# Altium schematic sheet MeteringIC.SchDoc
size 299 x 240 mm; SheetNumber: 4; SheetTotal: 7; ENG_APP_DATE: --/--/--; DSN_APP_DATE: --/--/--; CHK_APP_DATE: --/--/--
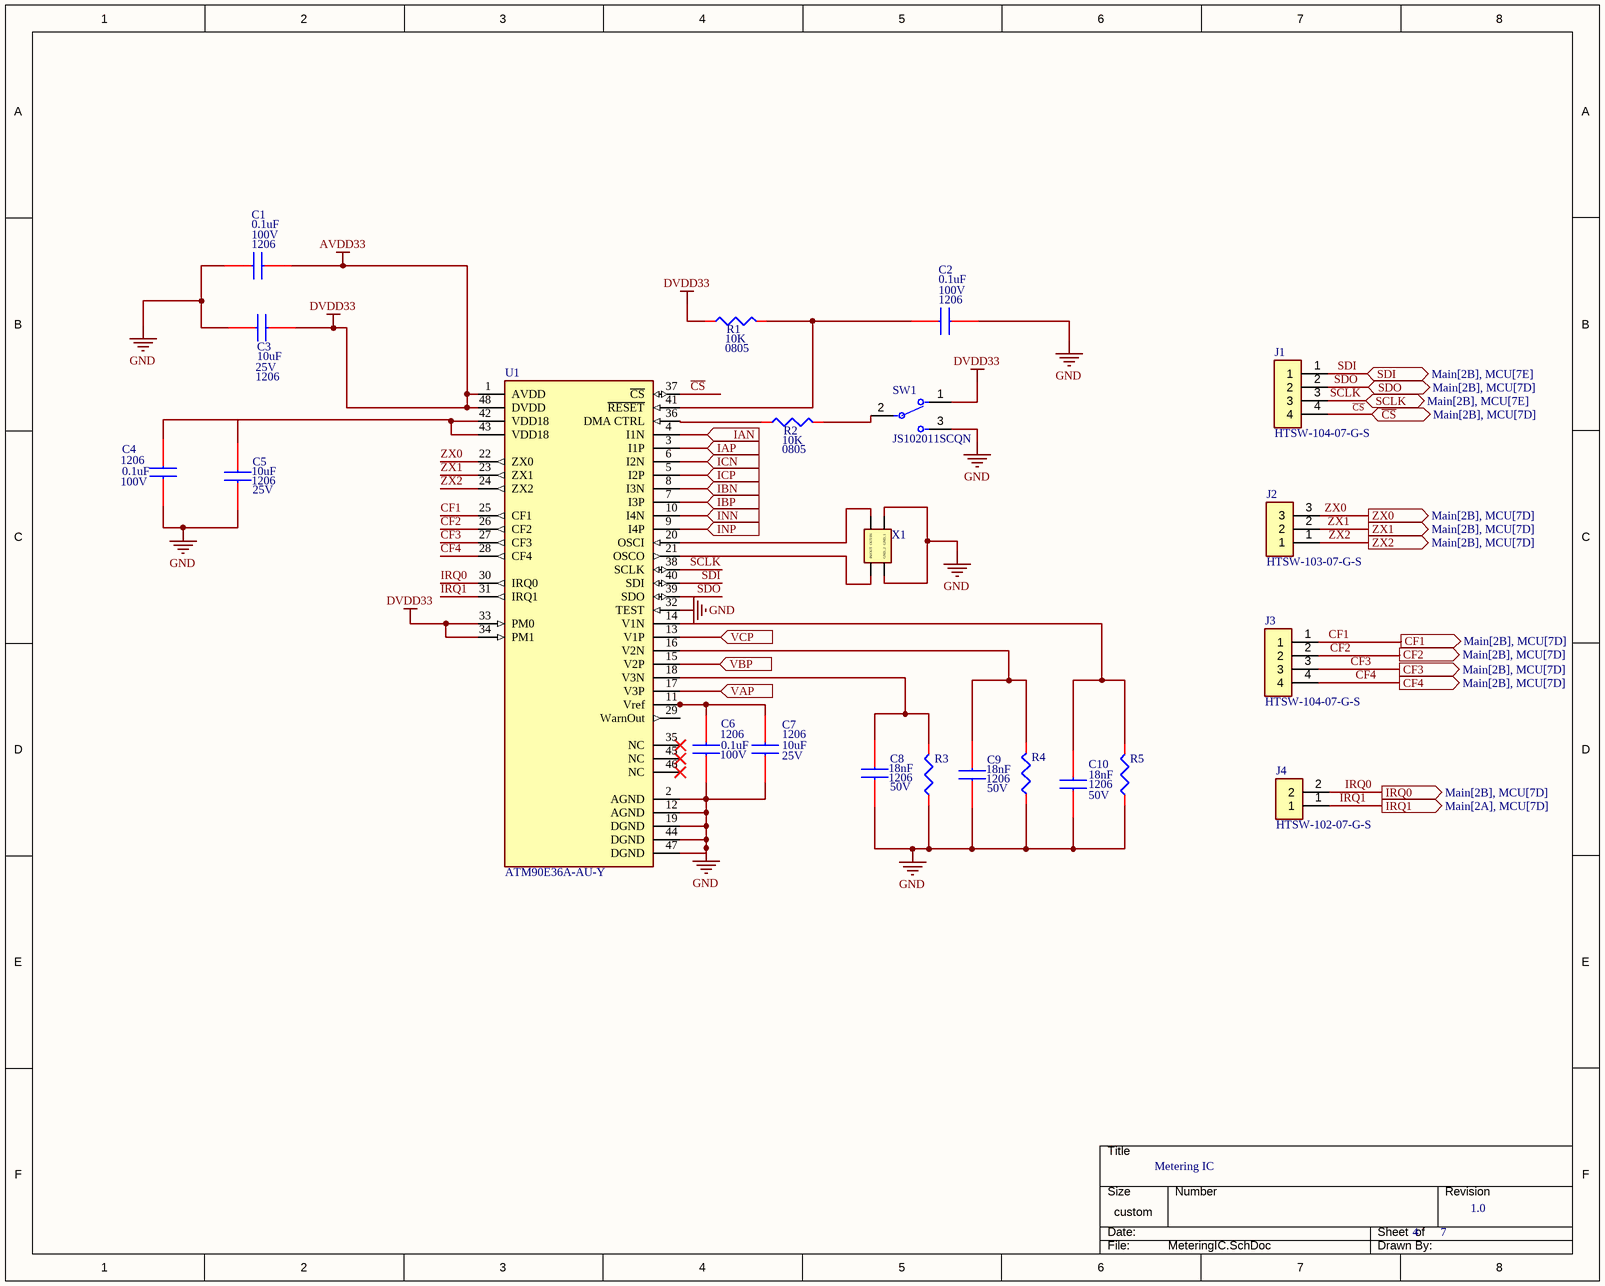
[diagram p0: MeteringIC.SchDoc]

## Parts
C1  Size: 1206  Capacitance: 0.1uF  Voltage: 100V  [CAPC3316X180N]  (hidden comment: C1206C104J1RACAUTO)
C2  Size: 1206  Capacitance: 0.1uF  Voltage: 100V  [CAPC3316X180N]  (hidden comment: C1206C104J1RACAUTO)
C3  Size: 1206  Capacitance: 10uF  Voltage: 25V  [CAPC3316X180N]  (hidden comment: MBAST31LAB7106KTNA01)
C4  Size: 1206  Capacitance: 0.1uF  Voltage: 100V  [CAPC3316X180N]  (hidden comment: C1206C104J1RACAUTO)
C5  Size: 1206  Capacitance: 10uF  Voltage: 25V  [CAPC3316X180N]  (hidden comment: MBAST31LAB7106KTNA01)
C6  Size: 1206  Capacitance: 0.1uF  Voltage: 100V  [CAPC3316X180N]  (hidden comment: C1206C104J1RACAUTO)
C7  Size: 1206  Capacitance: 10uF  Voltage: 25V  [CAPC3316X180N]  (hidden comment: MBAST31LAB7106KTNA01)
C8  Size: 1206  Capacitance: 18nF  Voltage: 50V  [CAPC3316X180N]  (hidden comment: C1206C183J5RACTU)
C9  Size: 1206  Capacitance: 18nF  Voltage: 50V  [CAPC3316X180N]  (hidden comment: C1206C183J5RACTU)
C10  Size: 1206  Capacitance: 18nF  Voltage: 50V  [CAPC3316X180N]  (hidden comment: C1206C183J5RACTU)
J1  HTSW-104-07-G-S  [HDRV4W64P0X254_1X4_1016X248X838P]
J2  HTSW-103-07-G-S  [HDRV3W64P0X254_1X3_749X249X858P]
J3  HTSW-104-07-G-S  [HDRV4W64P0X254_1X4_1016X248X838P]
J4  HTSW-102-07-G-S  [HDRV2W64P0X254_1X2_508X248X838P]
R1  Resistance: 10K  Size: 0805  [RESC2013X84N]  (hidden comment: CRCW201010K0JNEFIF)
R2  Resistance: 10K  Size: 0805  [RESC2013X84N]  (hidden comment: CRCW201010K0JNEFIF)
R3  ERA-6AED102V  [RESC2013X84N]  (value not drawn)
R4  ERA-6AED102V  [RESC2013X84N]  (value not drawn)
R5  ERA-6AED102V  [RESC2013X84N]  (value not drawn)
SW1  JS102011SCQN  [FP-JS102011SCQN-MFG]
U1  ATM90E36A-AU-Y  [FP-ATM90E36A-AU-Y-MFG]
X1  ECS-163.84-10-30B-CKM-TR  [ECS163841030BCKMTR]  (value not drawn)

## Ports
CF1 (out, see Main[2B], MCU[7D]), CF2 (out, see Main[2B], MCU[7D]), CF3 (out, see Main[2B], MCU[7D]), CF4 (out, see Main[2B], MCU[7D]), IAN (in, see Main[2C]), IAP (in, see Main[2C]), IBN (in, see Main[2C]), IBP (in, see Main[2C]), ICN (in, see Main[2C], CurrentSensorInput[5B]), ICP (in, see Main[2C], CurrentSensorInput[5C]), INN (in, see Main[2C], CurrentSensorInput[6E]), INP (in, see Main[2C], CurrentSensorInput[6D]), IRQ0 (out, see Main[2B], MCU[7D]), IRQ1 (out, see Main[2A], MCU[7D]), SCLK (bidir, see Main[2B], MCU[7E]), SDI (bidir, see Main[2B], MCU[7E]), SDO (bidir, see Main[2B], MCU[7D]), VAP (in, see Main[2B], VoltageSensorInput[1E]), VBP (in, see Main[2B], VoltageSensorInput[1D]), VCP (in, see Main[2B], VoltageSensorInput[1B]), ZX0 (out, see Main[2B], MCU[7D]), ZX1 (out, see Main[2B], MCU[7D]), ZX2 (out, see Main[2B], MCU[7D]), ~{CS} (bidir, see Main[2B], MCU[7D])

## Nets
AVDD33: C1.1 C3.1 R1.2 SW1.1 U1.1(AVDD) U1.33(PM0) U1.34(PM1) U1.48(DVDD)  [also labelled DVDD33]
GND: C1.2 C2.1 C3.2 C4.2 C5.2 C6.2 C7.2 C8.2 C9.2 C10.2 R3.2 R4.2 R5.2 SW1.3 U1.2(AGND) U1.12(AGND) U1.19(DGND) U1.32(TEST) U1.44(DGND) U1.47(DGND) X1.2(GND_1) X1.4(GND_2)
~{CS}: J1.4 U1.37(~{CS}) ; port ~{CS}
CF1: J3.1 U1.25(CF1) ; port CF1
CF2: J3.2 U1.26(CF2) ; port CF2
CF3: J3.3 U1.27(CF3) ; port CF3
CF4: J3.4 U1.28(CF4) ; port CF4
IAN: U1.4(I1N) ; port IAN
IAP: U1.3(I1P) ; port IAP
IBN: U1.8(I3N) ; port IBN
IBP: U1.7(I3P) ; port IBP
ICN: U1.6(I2N) ; port ICN
ICP: U1.5(I2P) ; port ICP
INN: U1.10(I4N) ; port INN
INP: U1.9(I4P) ; port INP
IRQ0: J4.2 U1.30(IRQ0) ; port IRQ0
IRQ1: J4.1 U1.31(IRQ1) ; port IRQ1
SCLK: J1.3 U1.38(SCLK) ; port SCLK
SDI: J1.1 U1.40(SDI) ; port SDI
SDO: J1.2 U1.39(SDO) ; port SDO
VAP: U1.17(V3P) ; port VAP
VBP: U1.15(V2P) ; port VBP
VCP: U1.13(V1P) ; port VCP
ZX0: J2.3 U1.22(ZX0) ; port ZX0
ZX1: J2.2 U1.23(ZX1) ; port ZX1
ZX2: J2.1 U1.24(ZX2) ; port ZX2
NetC2_2: C2.2 R1.1 U1.41(~{RESET})
NetC4_1: C4.1 C5.1 U1.42(VDD18) U1.43(VDD18)
NetC6_1: C6.1 C7.1 U1.11(Vref)
NetC8_1: C8.1 R3.1 U1.18(V3N)
NetC9_1: C9.1 R4.1 U1.16(V2N)
NetC10_1: C10.1 R5.1 U1.14(V1N)
NetR2_1: R2.1 SW1.2(C)
NetR2_2: R2.2 U1.36(DMA_CTRL)
NetU1_20: U1.20(OSCI) X1.3(OUT/IN)
NetU1_21: U1.21(OSCO) X1.1(IN/OUT)

Not connected (* = marked no-connect by the designer): U1 29(WarnOut) 35(NC)* 45(NC)* 46(NC)*

## Notes on the sheet
- Metering IC
- 4
- 7
- 1.0
- DWG. NO.
- REV.
- SHT.
- THIS DOCUMENT AND THE DATA DISCLOSED HEREIN OR HEREWITH IS THE PROPERTY OF ALTIUM LIMITED AND MAY BE FREELY DISTRIBUTED IN WHOLE. NO RIGHTS ARE RESERVED OR EXPRESS OR IMPLIED WARANTEE GIVEN.
- REVISION
- DESCRIPTION
- DATE
- APPROVED
- ENG:
- APPROVALS
- PROJECT
- DSN:
- CHK:
- REFERENCE DOCUMENTS
- PROJECT REVISION:
- TITLE
- DOCUMENT REVISION:
- DESIGN ITEM:
- BOM:
- FAB DWG:
- PCB DWG:
- ASSY DWG:
- SCALE:
- SIZE
- B
- CAGE CODE
- FILE NAME
- DWG NO.
- SHEET
- OF
- REV

## Library data of the parts
C1 C2 C4 C6 = C1206X224KARACAUTO: Multilayer Ceramic Capacitors MLCC - SMD/SMT 100V 0.1uF X7R 1206 5% AEC-Q200; Manufacturer_Name: KEMET; Geometry.Height: 1.8mm; Mouser Part Number: 80-C1206X224KARAUTO; Mouser Price/Stock: https://www.mouser.co.uk/ProductDetail/KEMET/C1206X224KARACAUTO?qs=zW32dvEIR3ul9TqTUrs40g%3D%3D; Manufacturer_Part_Number: C1206X224KARACAUTO; Datasheet Link: https://search.kemet.com/component-documentation/download/specsheet/C1206X224KARACAUTO
C3 C5 C7 = C1206X224KARACAUTO: Multilayer Ceramic Capacitors MLCC - SMD/SMT 25V 10uF X7R 1206 10%; Manufacturer_Name: KEMET; Geometry.Height: 1.8mm; Mouser Part Number: 80-C1206X224KARAUTO; Mouser Price/Stock: https://www.mouser.co.uk/ProductDetail/KEMET/C1206X224KARACAUTO?qs=zW32dvEIR3ul9TqTUrs40g%3D%3D; Manufacturer_Part_Number: C1206X224KARACAUTO; Datasheet Link: https://search.kemet.com/component-documentation/download/specsheet/C1206X224KARACAUTO
C8-C10 = C1206X224KARACAUTO: Multilayer Ceramic Capacitors MLCC - SMD/SMT 50V 0.018uF X7R 1206 5%; Manufacturer_Name: KEMET; Geometry.Height: 1.8mm; Mouser Part Number: 80-C1206X224KARAUTO; Mouser Price/Stock: https://www.mouser.co.uk/ProductDetail/KEMET/C1206X224KARACAUTO?qs=zW32dvEIR3ul9TqTUrs40g%3D%3D; Manufacturer_Part_Number: C1206X224KARACAUTO; Datasheet Link: https://search.kemet.com/component-documentation/download/specsheet/C1206X224KARACAUTO
J1 J3 = HTSW-104-07-G-S: SAMTEC - HTSW-104-07-G-S - , , 2.54 mm, 4 , , HTSW Series, , 1; Geometry.Height: 8.38mm; Mouser Part Number: 200-HTSW10407GS; Mouser Price/Stock: https://www.mouser.co.uk/ProductDetail/Samtec/HTSW-104-07-G-S?qs=0lQeLiL1qyYqiS2uxGtRCQ%3D%3D; Manufacturer_Name: SAMTEC; Manufacturer_Part_Number: HTSW-104-07-G-S; Datasheet Link: https://componentsearchengine.com/Datasheets/2/HTSW-104-07-G-S.pdf
J2 = HTSW-103-07-G-S: Samtec HTSW, 2.54mm Pitch, 3 Way, 1 Row, Vertical Pin Header, Through Hole; Geometry.Height: 8.58mm; Mouser Part Number: 200-HTSW10307GS; Mouser Price/Stock: https://www.mouser.co.uk/ProductDetail/Samtec/HTSW-103-07-G-S?qs=0lQeLiL1qyYZ%252B%2F6nDbu9tg%3D%3D; Manufacturer_Name: SAMTEC; Manufacturer_Part_Number: HTSW-103-07-G-S; Datasheet Link: http://suddendocs.samtec.com/prints/htsw-xxx-xx-xxx-x-xx-xx-xx-mkt.pdf
J4 = HTSW-102-07-G-S: Samtec, HTSW, 2 Way, 1 Row, Vertical Pin Header; Geometry.Height: 8.38mm; Mouser Part Number: 200-HTSW10207GS; Mouser Price/Stock: https://www.mouser.co.uk/ProductDetail/Samtec/HTSW-102-07-G-S?qs=FESYatJ8odI1BCBanfu%2FIg%3D%3D; Manufacturer_Name: SAMTEC; Manufacturer_Part_Number: HTSW-102-07-G-S; Datasheet Link: http://suddendocs.samtec.com/prints/htsw-xxx-xx-xxx-x-xx-xx-xx-mkt.pdf
R1 R2 = WSL080500000ZEA9: VISHAY - CRCW201010K0JNEFIF - SMD Chip Resistor, Jumper, 0805 [2012 Metric], 10k, WSL-9 Series, Metal Strip; Geometry.Height: 0.838mm; Mouser Part Number: 71-WSL080500000ZEA9; Mouser Price/Stock: https://www.mouser.co.uk/ProductDetail/Vishay-Dale/WSL080500000ZEA9?qs=f1l5vAGoKgsImKS87N8TmQ%3D%3D; Manufacturer_Name: Vishay; Manufacturer_Part_Number: WSL080500000ZEA9; Datasheet Link: https://ad.componentsearchengine.com/Datasheets/2/WSL080500000ZEA9.pdf
R3-R5 = ERA-6AED102V: Thin Film Resistors - SMD 0805 1000ohms 25ppm 0.5% AEC-Q200; Manufacturer_Name: Panasonic; Geometry.Height: 0.6mm; Mouser Part Number: 667-ERA-6AED102V; Mouser Price/Stock: https://www.mouser.co.uk/ProductDetail/Panasonic/ERA-6AED102V?qs=MNPzkKEzRtTAvKH%252BuMqwyg%3D%3D; Manufacturer_Part_Number: ERA-6AED102V; Datasheet Link: https://industrial.panasonic.com/cdbs/www-data/pdf/RDM0000/AOA0000C307.pdf
SW1 = CMP-10038-000023-1: SWITCH SLIDE SPDT 300MA 6V; Electrical Life: 5000Cycles; Actuator Type: Standard; Contact Resistance: 70mR; Actuator Material: Nylon; Max Voltage Rating (DC): 30V; Actuator Length: 2mm; Switch Function: On-On; Actuator Color: Black; Radiation Hardening: No; Throw Configuration: SPDT; Depth: 7.5mm; Case/Package: SMD/SMT; Package Quantity: 4000; Min Operating Temperature: -40°C; Length: 8.5mm; Current Rating: 300mA; Mount: Surface Mount; Voltage Rating (DC): 6V; RoHS Compliant: Yes; Orientation: Straight; Housing Material: Nylon; Contact Plating: Silver; Max Operating Temperature: 85°C; Packaging: Tape and Reel; Switch Travel: 2mm; Max Current Rating: 300mA; Contact Material: Copper Alloy; Series: JS; Termination: Gull Wing
U1 = CMP-06317-000017-1: 48-TQFP, IND TEMP, 1.8V/3V, TRAY; RoHS Compliant: Yes
X1 = ECS-163.84-10-30B-CKM-TR: Crystals 16.384MHz 10ppm 10pF -20C +70C; Manufacturer_Name: ECS; Geometry.Height: 0.85mm; Mouser Part Number: 520-163.84-1030BCKMT; Mouser Price/Stock: https://www.mouser.com/Search/Refine.aspx?Keyword=520-163.84-1030BCKMT; Manufacturer_Part_Number: ECS-163.84-10-30B-CKM-TR; Datasheet Link: https://componentsearchengine.com/Datasheets/1/ECS-163.84-10-30B-CKM-TR.pdf